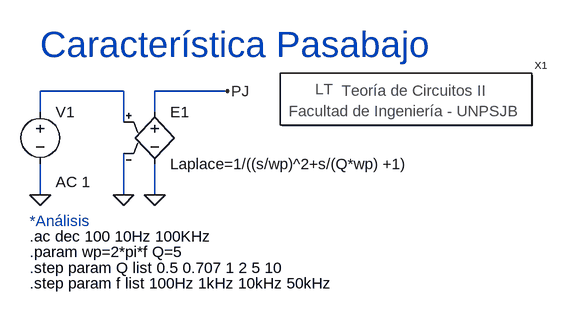
[diagram p0: schematic característicafiltropasabajo.asc]
característicafiltropasabajo.asc, the LTspice schematic file:
Version 4
SHEET 1 880 680
WIRE 128 96 0 96
WIRE 288 96 176 96
WIRE 0 128 0 96
WIRE 176 128 176 96
WIRE 128 144 128 96
WIRE 0 256 0 208
WIRE 128 256 128 192
WIRE 176 256 176 208
FLAG 288 96 PJ
FLAG 176 256 0
FLAG 128 256 0
FLAG 0 256 0
SYMBOL voltage 0 112 R0
WINDOW 123 24 124 Left 2
WINDOW 39 0 0 Left 0
SYMATTR InstName V1
SYMATTR Value ""
SYMATTR Value2 AC 1
SYMBOL e 176 112 R0
SYMATTR InstName E1
SYMATTR Value Laplace=1/((s/wp)^2+s/(Q*wp) +1)
SYMBOL Circuitos2\\Letreros\\Teoría\ de\ Circuitos\ II 560 112 R0
SYMATTR InstName X1
TEXT -16 296 Left 2 ;*Análisis
TEXT -16 320 Left 2 !.ac dec 100 10Hz 100KHz
TEXT -16 344 Left 2 !.param wp=2*pi*f Q=5
TEXT -16 368 Left 2 !.step param Q list 0.5 0.707 1 2 5 10
TEXT -16 392 Left 2 !.step param f list 100Hz 1kHz 10kHz 50kHz
TEXT 0 24 Left 5 ;Característica Pasabajo

The netlist it stands for:
* característicafiltropasabajo.asc
V1 N001 0 AC 1
E1 PJ 0 N001 0 Laplace=1/((s/wp)^2+s/(Q*wp) +1)
XX1 Teoría de Circuitos II
* *Análisis
.ac dec 100 10Hz 100KHz
.param wp=2*pi*f Q=5
.step param Q list 0.5 0.707 1 2 5 10
.step param f list 100Hz 1kHz 10kHz 50kHz
* Característica Pasabajo
.backanno
.end